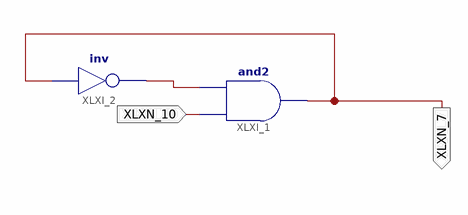
[diagram p0: schematic sheet 1]
// Xilinx ISE schematic d.sch (spartan3e) as structural Verilog: 2 symbols, 2 ports
module d (
  input  XLXN_10,
  output XLXN_7
);

  wire XLXN_8;

  and XLXI_1 (XLXN_7, XLXN_10, XLXN_8);
  not XLXI_2 (XLXN_8, XLXN_7);
endmodule
